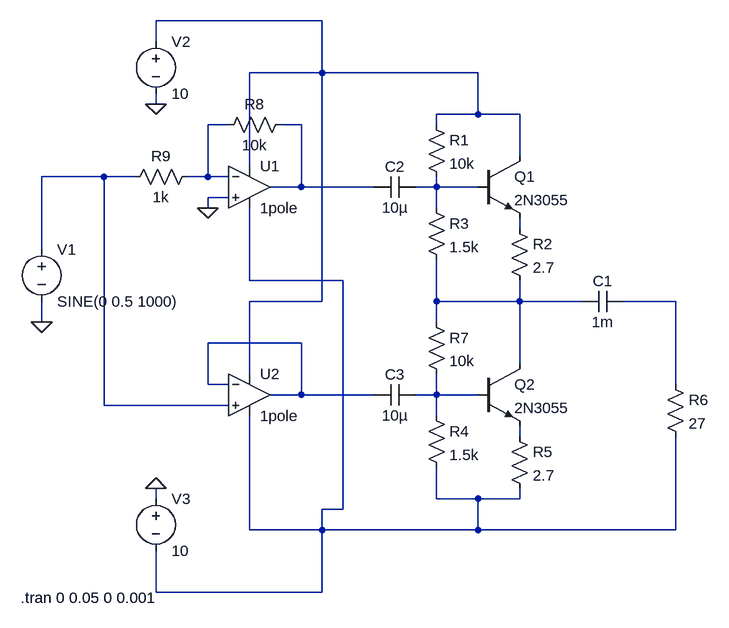
[diagram p0: schematic Lab1.asc]
Lab1.asc, the LTspice schematic file:
Version 4
SHEET 1 880 760
WIRE -80 -144 -336 -144
WIRE -336 -112 -336 -144
WIRE -80 -64 -80 -144
WIRE -80 -64 -192 -64
WIRE 160 -64 -80 -64
WIRE -336 -16 -336 -32
WIRE 160 0 160 -64
WIRE 160 0 96 0
WIRE 224 0 160 0
WIRE -224 16 -256 16
WIRE -112 16 -144 16
WIRE 96 16 96 0
WIRE 224 64 224 0
WIRE -192 80 -192 -64
WIRE -416 96 -512 96
WIRE -368 96 -416 96
WIRE -256 96 -256 16
WIRE -256 96 -288 96
WIRE -224 96 -256 96
WIRE -112 112 -112 16
WIRE -112 112 -160 112
WIRE 0 112 -112 112
WIRE 96 112 96 96
WIRE 96 112 64 112
WIRE 160 112 96 112
WIRE -224 128 -256 128
WIRE -256 144 -256 128
WIRE 96 144 96 112
WIRE 224 176 224 160
WIRE -512 208 -512 96
WIRE -192 256 -192 144
WIRE -48 256 -192 256
WIRE -80 288 -80 -64
WIRE -80 288 -192 288
WIRE 96 288 96 224
WIRE 224 288 224 256
WIRE 224 288 96 288
WIRE 320 288 224 288
WIRE 464 288 384 288
WIRE -512 320 -512 288
WIRE 96 320 96 288
WIRE -112 352 -256 352
WIRE 224 384 224 288
WIRE -192 400 -192 288
WIRE -256 416 -256 352
WIRE -224 416 -256 416
WIRE 464 416 464 288
WIRE -112 432 -112 352
WIRE -112 432 -160 432
WIRE 0 432 -112 432
WIRE 96 432 96 400
WIRE 96 432 64 432
WIRE 160 432 96 432
WIRE -416 448 -416 96
WIRE -224 448 -416 448
WIRE 96 464 96 432
WIRE 224 496 224 480
WIRE -336 592 -336 576
WIRE 96 592 96 544
WIRE 160 592 96 592
WIRE 224 592 224 576
WIRE 224 592 160 592
WIRE -48 608 -48 256
WIRE -48 608 -80 608
WIRE -192 640 -192 464
WIRE -80 640 -80 608
WIRE -80 640 -192 640
WIRE 160 640 160 592
WIRE 160 640 -80 640
WIRE 464 640 464 496
WIRE 464 640 160 640
WIRE -336 736 -336 672
WIRE -80 736 -80 640
WIRE -80 736 -336 736
FLAG -256 144 0
FLAG -512 320 0
FLAG -336 -16 0
FLAG -336 576 0
SYMBOL npn 160 64 R0
SYMATTR InstName Q1
SYMATTR Value 2N3055
SYMBOL npn 160 384 R0
SYMATTR InstName Q2
SYMATTR Value 2N3055
SYMBOL res 80 0 R0
SYMATTR InstName R1
SYMATTR Value 10k
SYMBOL res 208 160 R0
SYMATTR InstName R2
SYMATTR Value 2.7
SYMBOL res 80 128 R0
SYMATTR InstName R3
SYMATTR Value 1.5k
SYMBOL res 80 448 R0
SYMATTR InstName R4
SYMATTR Value 1.5k
SYMBOL res 208 480 R0
SYMATTR InstName R5
SYMATTR Value 2.7
SYMBOL res 448 400 R0
SYMATTR InstName R6
SYMATTR Value 27
SYMBOL cap 384 272 R90
WINDOW 0 0 32 VBottom 0
WINDOW 3 32 32 VTop 0
SYMATTR InstName C1
SYMATTR Value 1m
SYMBOL cap 64 96 R90
WINDOW 0 0 32 VBottom 0
WINDOW 3 32 32 VTop 0
SYMATTR InstName C2
SYMATTR Value 10µ
SYMBOL cap 64 416 R90
WINDOW 0 0 32 VBottom 0
WINDOW 3 32 32 VTop 0
SYMATTR InstName C3
SYMATTR Value 10µ
SYMBOL res 80 304 R0
SYMATTR InstName R7
SYMATTR Value 10k
SYMBOL Opamps\\1pole -192 112 R0
SYMATTR InstName U1
SYMBOL Opamps\\1pole -192 432 R0
SYMATTR InstName U2
SYMBOL res -128 0 R90
WINDOW 0 0 56 VBottom 0
WINDOW 3 32 56 VTop 0
SYMATTR InstName R8
SYMATTR Value 10k
SYMBOL res -272 80 R90
WINDOW 0 0 56 VBottom 0
WINDOW 3 32 56 VTop 0
SYMATTR InstName R9
SYMATTR Value 1k
SYMBOL voltage -512 192 R0
WINDOW 123 0 0 Left 0
WINDOW 39 0 0 Left 0
SYMATTR InstName V1
SYMATTR Value SINE(0 0.5 1000)
SYMBOL voltage -336 -128 R0
WINDOW 123 0 0 Left 0
WINDOW 39 0 0 Left 0
SYMATTR InstName V2
SYMATTR Value 10
SYMBOL voltage -336 576 R0
WINDOW 123 0 0 Left 0
WINDOW 39 0 0 Left 0
SYMATTR InstName V3
SYMATTR Value 10
TEXT -544 744 Left 0 !.tran 0 0.05 0 0.001

The netlist it stands for:
* Lab1.asc
Q1 N001 N005 N006 0 2N3055
Q2 N008 N011 N012 0 2N3055
R1 N001 N005 10k
R2 N006 N008 2.7
R3 N005 N008 1.5k
R4 N011 N007 1.5k
R5 N012 N007 2.7
R6 N009 N007 27
C1 N009 N008 1m
C2 N005 N003 10µ
C3 N011 N010 10µ
R7 N008 N011 10k
* U1: 1pole (symbol Opamps\1pole not available, pins judged from their places): In+=0 In-=N002 V+=N001 V-=N007 OUT=N003
* U2: 1pole (symbol Opamps\1pole not available, pins judged from their places): In+=N004 In-=N010 V+=N001 V-=N007 OUT=N010
R8 N003 N002 10k
R9 N002 N004 1k
V1 N004 0 SINE(0 0.5 1000)
V2 N001 0 10
V3 0 N007 10
.model NPN NPN
.model PNP PNP
.lib standard.bjt
.tran 0 0.05 0 0.001
.backanno
.end